# Altium project 3923Final.PrjPcb
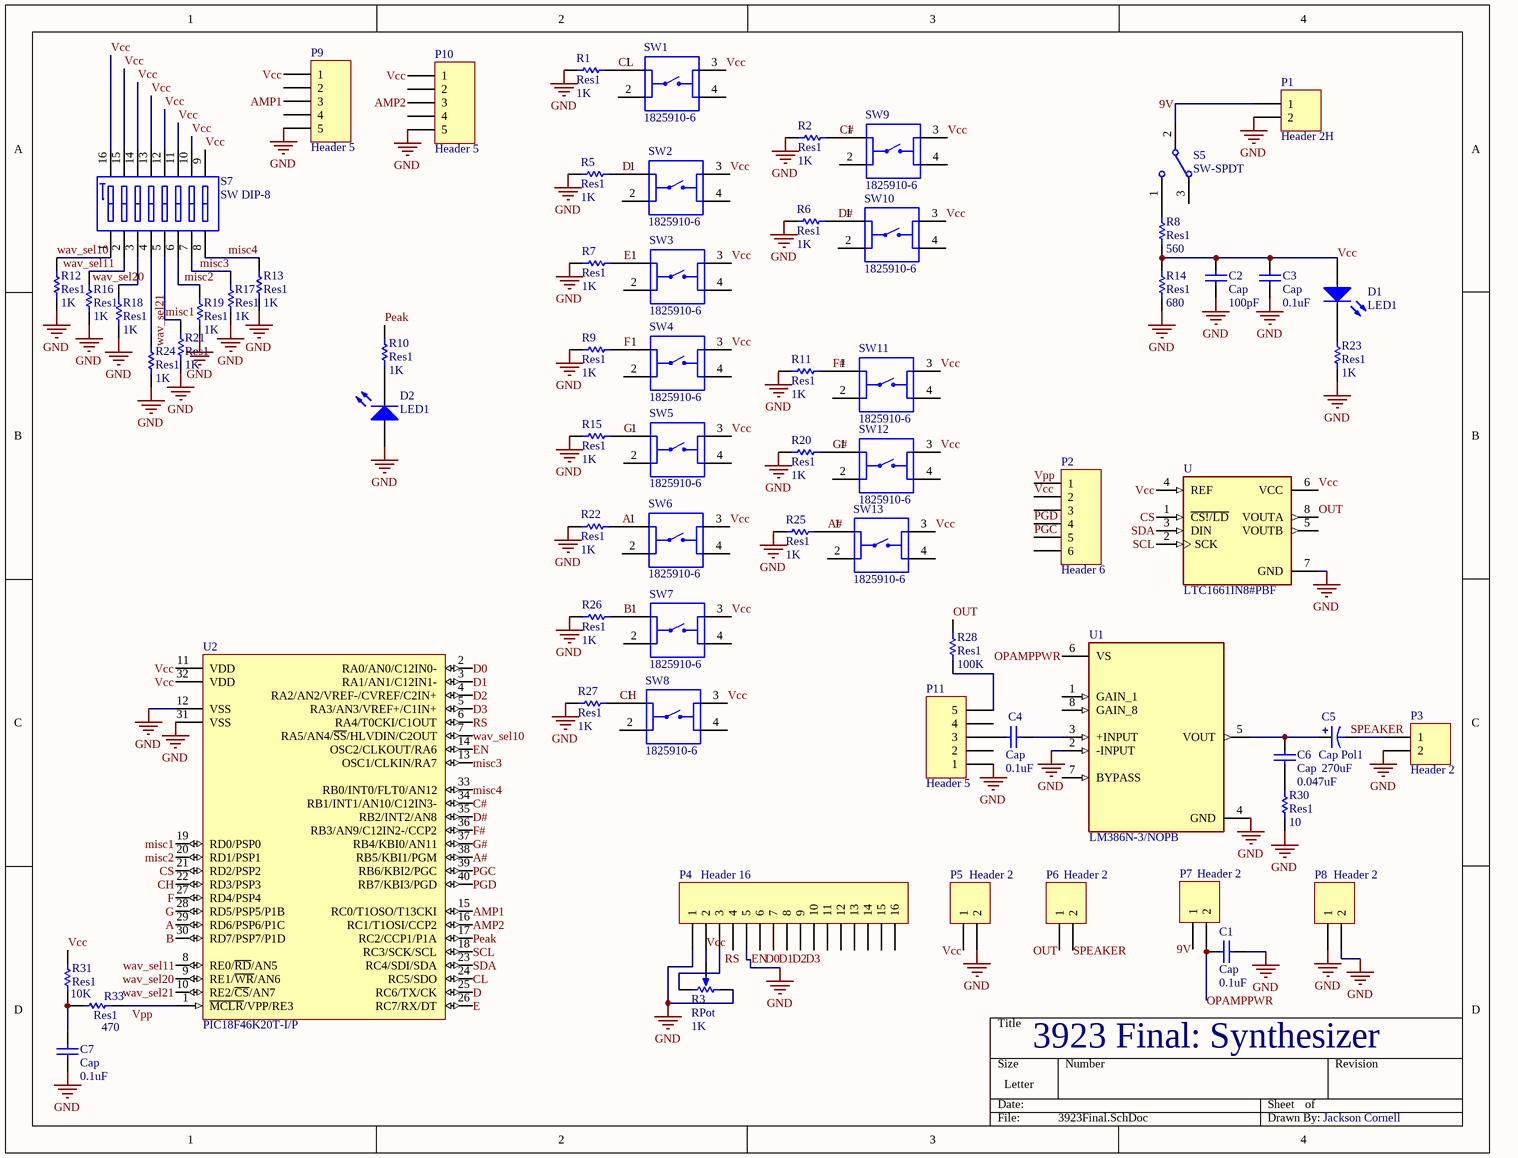
[diagram p0: 3923Final.SchDoc]
1 sheet, 68 parts. Net scope: global (net labels, ports and power ports of the same name join across sheets).
Board file: 3923Final.PcbDoc

## Sheet 3923Final.SchDoc
size Letter

### Parts
C1  Cap  value 0.1uF  [RAD-0.3]
C2  Cap  value 100pF  [RAD-0.3]
C3  Cap  value 0.1uF  [RAD-0.3]
C4  Cap  value 0.1uF  [RAD-0.3]
C5  Cap Pol1  value 270uF  [RB7.6-15]
C6  Cap  value 0.047uF  [RAD-0.3]
C7  Cap  value 0.1uF  [RAD-0.3]
D1  LED1  [LED-1]
D2  LED1  [LED-1]
P1  Header 2H  [HDR1X2H]
P2  Header 6  [HDR1X6]
P3  Header 2  [HDR1X2]
P4  Header 16  [HDR1X16]
P5  Header 2  [HDR1X2]
P6  Header 2  [HDR1X2]
P7  Header 2  [HDR1X2]
P8  Header 2  [HDR1X2]
P9  Header 5  [HDR1X5]
P10  Header 5  [HDR1X5]
P11  Header 5  [HDR1X5]
R1  Res1  value 1K  [AXIAL-0.3]
R2  Res1  value 1K  [AXIAL-0.3]
R3  RPot  value 1K  [VR5]
R5  Res1  value 1K  [AXIAL-0.3]
R6  Res1  value 1K  [AXIAL-0.3]
R7  Res1  value 1K  [AXIAL-0.3]
R8  Res1  value 560  [AXIAL-0.3]
R9  Res1  value 1K  [AXIAL-0.3]
R10  Res1  value 1K  [AXIAL-0.3]
R11  Res1  value 1K  [AXIAL-0.3]
R12  Res1  value 1K  [AXIAL-0.3]
R13  Res1  value 1K  [AXIAL-0.3]
R14  Res1  value 680  [AXIAL-0.3]
R15  Res1  value 1K  [AXIAL-0.3]
R16  Res1  value 1K  [AXIAL-0.3]
R17  Res1  value 1K  [AXIAL-0.3]
R18  Res1  value 1K  [AXIAL-0.3]
R19  Res1  value 1K  [AXIAL-0.3]
R20  Res1  value 1K  [AXIAL-0.3]
R21  Res1  value 1K  [AXIAL-0.3]
R22  Res1  value 1K  [AXIAL-0.3]
R23  Res1  value 1K  [AXIAL-0.3]
R24  Res1  value 1K  [AXIAL-0.3]
R25  Res1  value 1K  [AXIAL-0.3]
R26  Res1  value 1K  [AXIAL-0.3]
R27  Res1  value 1K  [AXIAL-0.3]
R28  Res1  value 100K  [AXIAL-0.3]
R30  Res1  value 10  [AXIAL-0.3]
R31  Res1  value 10K  [AXIAL-0.3]
R33  Res1  value 470  [AXIAL-0.3]
S5  SW-SPDT  [TL36WW15050]
S7  SW DIP-8  [DIP-16]
SW1  1825910-6  [SW_1825910-6-4]
SW2  1825910-6  [SW_1825910-6-4]
SW3  1825910-6  [SW_1825910-6-4]
SW4  1825910-6  [SW_1825910-6-4]
SW5  1825910-6  [SW_1825910-6-4]
SW6  1825910-6  [SW_1825910-6-4]
SW7  1825910-6  [SW_1825910-6-4]
SW8  1825910-6  [SW_1825910-6-4]
SW9  1825910-6  [SW_1825910-6-4]
SW10  1825910-6  [SW_1825910-6-4]
SW11  1825910-6  [SW_1825910-6-4]
SW12  1825910-6  [SW_1825910-6-4]
SW13  1825910-6  [SW_1825910-6-4]
U  LTC1661IN8#PBF  [DIP794W45P254L959H508Q8]
U1  LM386N-3/NOPB  [DIP794W45P254L959H508Q8]
U2  PIC18F46K20T-I/P  [PDIP600-P40]

### Nets
GND: C1.1 C2.1 C3.1 C7.1 D2.1(A) P1.2 P3.2 P4.1 P4.5 P5.2 P8.1 P8.2 P9.5 P10.5 P11.1 R1.1 R2.2 R3.1(TOP) R5.2 R6.2 R7.2 R9.2 R11.2 R12.1 R13.2 R14.1 R15.2 R16.1 R17.2 R18.2 R19.2 R20.2 R21.2 R22.2 R23.2 R24.2 R25.2 R26.2 R27.2 R30.2 U.7(GND) U1.2(-INPUT) U1.4(GND) U2.12(VSS) U2.31(VSS)
9V: P1.1 P7.1 S5.2
A: R22.1 SW6.1 U2.29(RD6/PSP6/P1C)
A#: R25.1 SW13.1 U2.38(RB5/KBI1/PGM)
AMP1: P9.3 U2.15(RC0/T1OSO/T13CKI)
AMP2: P10.3 U2.16(RC1/T1OSI/CCP2)
B: R26.1 SW7.1 U2.30(RD7/PSP7/P1D)
C#: R2.1 SW9.1 U2.34(RB1/INT1/AN10/C12IN3-)
CH: R27.1 SW8.1 U2.22(RD3/PSP3)
CL: R1.2 SW1.1 U2.24(RC5/SDO)
CS: U.1(~{CS!/LD}) U2.21(RD2/PSP2)
D: R5.1 SW2.1 U2.25(RC6/TX/CK)
D0: P4.7 U2.2(RA0/AN0/C12IN0-)
D1: P4.8 U2.3(RA1/AN1/C12IN1-)
D2: P4.9 U2.4(RA2/AN2/VREF-/CVREF/C2IN+)
D3: P4.10 U2.5(RA3/AN3/VREF+/C1IN+)
D#: R6.1 SW10.1 U2.35(RB2/INT2/AN8)
E: R7.1 SW3.1 U2.26(RC7/RX/DT)
EN: P4.6 U2.14(OSC2/CLKOUT/RA6)
F: R9.1 SW4.1 U2.27(RD4/PSP4)
F#: R11.1 SW11.1 U2.36(RB3/AN9/C12IN2-/CCP2)
G: R15.1 SW5.1 U2.28(RD5/PSP5/P1B)
G#: R20.1 SW12.1 U2.37(RB4/KBI0/AN11)
misc1: R21.1 S7.5(A5) U2.19(RD0/PSP0)
misc2: R19.1 S7.6(A6) U2.20(RD1/PSP1)
misc3: R17.1 S7.7(A7) U2.13(OSC1/CLKIN/RA7)
misc4: R13.1 S7.8(A8) U2.33(RB0/INT0/FLT0/AN12)
OPAMPPWR: C1.2 P7.2 U1.6(VS)
OUT: P6.1 R28.2 U.8(VOUTA)
Peak: R10.1 U2.17(RC2/CCP1/P1A)
PGC: P2.5 U2.39(RB6/KBI2/PGC)
PGD: P2.4 U2.40(RB7/KBI3/PGD)
RS: P4.4 U2.6(RA4/T0CKI/C1OUT)
SCL: U.2(SCK) U2.18(RC3/SCK/SCL)
SDA: U.3(DIN) U2.23(RC4/SDI/SDA)
SPEAKER: C5.2 P3.1 P6.2
Vcc: C2.2 C3.2 D1.1(A) P2.2 P4.2 P5.1 P9.1 P10.1 R3.3(TAP) R8.1 R14.2 R31.2 S7.9(B8) S7.10(B7) S7.11(B6) S7.12(B5) S7.13(B4) S7.14(B3) S7.15(B2) S7.16(B1) SW1.3 SW2.3 SW3.3 SW4.3 SW5.3 SW6.3 SW7.3 SW8.3 SW9.3 SW10.3 SW11.3 SW12.3 SW13.3 U.4(REF) U.6(VCC) U2.11(VDD) U2.32(VDD)
Vpp: P2.1 R33.1 U2.1(~{MCLR}/VPP/RE3)
wav_sel10: R12.2 S7.1(A1) U2.7(RA5/AN4/~{SS}/HLVDIN/C2OUT)
wav_sel11: R16.2 S7.2(A2) U2.8(RE0/~{RD}/AN5)
wav_sel20: R18.1 S7.3(A3) U2.9(RE1/~{WR}/AN6)
wav_sel21: R24.1 S7.4(A4) U2.10(RE2/~{CS}/AN7)
NetC4_1: C4.1 P11.3
NetC4_2: C4.2 U1.3(+INPUT)
NetC5_1: C5.1 C6.2 U1.5(VOUT)
NetC6_1: C6.1 R30.1
NetC7_2: C7.2 R31.1 R33.2
NetD1_2: D1.2(K) R23.1
NetD2_2: D2.2(K) R10.2
NetP4_3: P4.3 R3.2(BOT)
NetP11_5: P11.5 R28.1
NetR8_2: R8.2 S5.1

Not connected (* = marked no-connect by the designer): P2 3 6; P4 11 12 13 14 15 16; P9 2 4; P10 2 4; P11 2 4; S5 3; SW1 2 4; SW2 2 4; SW3 2 4; SW4 2 4; SW5 2 4; SW6 2 4; SW7 2 4; SW8 2 4; SW9 2 4; SW10 2 4; SW11 2 4; SW12 2 4; SW13 2 4; U 5(VOUTB); U1 1(GAIN_1) 7(BYPASS) 8(GAIN_8)

### Notes on the sheet
- 3923 Final: Synthesizer
- Jackson Cornell

### Library data of the parts
C1-C4 C6 C7 = Cap: Capacitor; Published: 8-Jun-2000; LatestRevisionDate: 17-Jul-2002; LatestRevisionNote: Re-released for DXP Platform.; PackageReference: RAD-0.3; Publisher: Altium Limited; PackageDescription: Radial Cap, Thru-Hole; 2 Leads; 0.3 in Pin Spacing
C5 = Cap Pol1: Polarized Capacitor (Radial); Published: 8-Jun-2000; LatestRevisionDate: 17-Jul-2002; LatestRevisionNote: Re-released for DXP Platform.; PackageReference: RB7.6-15; Publisher: Altium Limited; PackageDescription: Polarized Capacitor (Radial); 2 Leads
D1 D2 = LED1: Typical RED GaAs LED; Published: 8-Jun-2000; LatestRevisionDate: 08-Jul-2005; LatestRevisionNote: Mech Layer 1 removed.; PackageReference: LED-1; Publisher: Altium Limited; PackageDescription: LED; 2 Leads
P1 = Header 2H: Header, 2-Pin, Right Angle; LatestRevisionDate: 17-Jul-2002; LatestRevisionNote: Re-released for DXP Platform.; Publisher: Altium Limited
P2 = Header 6: Header, 6-Pin; LatestRevisionDate: 17-Jul-2002; LatestRevisionNote: Re-released for DXP Platform.; Publisher: Altium Limited
P3 P5-P8 = Header 2: Header, 2-Pin; LatestRevisionDate: 17-Jul-2002; LatestRevisionNote: Re-released for DXP Platform.; Publisher: Altium Limited
P4 = Header 16: Header, 16-Pin; LatestRevisionDate: 17-Jul-2002; LatestRevisionNote: Re-released for DXP Platform.; Publisher: Altium Limited
P9-P11 = Header 5: Header, 5-Pin; LatestRevisionDate: 17-Jul-2002; LatestRevisionNote: Re-released for DXP Platform.; Publisher: Altium Limited
R1 R2 R5-R28 R30 R31 R33 = Res1: Resistor; Published: 8-Jun-2000; LatestRevisionDate: 17-Jul-2002; LatestRevisionNote: Re-released for DXP Platform.; PackageReference: AXIAL-0.3; Publisher: Altium Limited; PackageDescription: Axial Device, Thru-Hole; 2 Leads; 0.3 in Pin Spacing
R3 = RPot: Potentiometer; Sim Note: Enter the Resistance value and the set point into parameter fields.; Set Position: 0.5; Published: 8-Jun-2000; LatestRevisionDate: 17-Jul-2002; LatestRevisionNote: Re-released for DXP Platform.; PackageReference: VR5; Publisher: Altium Limited; PackageDescription: Variable Resistor, Thru-Hole; 3 Leads
S5 = SW-SPDT: SPDT Subminiature Toggle Switch, Right Angle Mounting, Vertical Actuation; Published: 24-Mar-1999; LatestRevisionDate: 17-Dec-2003; LatestRevisionNote: Schematic revised, PCB Footprint replaced.; DatasheetVersion: 05-Dec-2000; PackageReference: TL36WW15050; Publisher: Altium Limited; PackageDescription: Switch; 4 Leads; ComponentLink1Description: Manufacturer Link; ComponentLink1URL: http://www.apem.com
S7 = SW DIP-8: DIP Switch, 8 Position, SPST; Published: 24-Mar-1999; LatestRevisionDate: 17-Jul-2002; LatestRevisionNote: Re-released for DXP Platform.; PackageReference: DIP_SW_8WAY_SMD; Publisher: Altium Limited; PackageDescription: DIP Switch; 16 Leads
SW1-SW13 = 1825910-6: Switch Push Button OFF _ON_ SPST Round Button 0.05A 24VDC Momentary Contact PC Pins Thru-Hole; Configuration_Pole-Throw: Single Pole - Single Throw; MF: TE Connectivity; Contact_Current_Rating: 50 mA; Digi-Key_Purchase_URL: https://www.digikey.com/product-detail/en/te-connectivity-alcoswitch-switches/1825910-6/450-1650-ND/1632536?utm_source=snapeda&utm_medium=aggregator&utm_campaign=symbol; TE_purchase_URL: https://www.te.com/usa-en/product-1825910-6.html?te_bu=Cor&te_type=disp&te_campaign=seda_glo_cor-seda-global-disp-prtnr-fy19-seda-model-bom-cta_sma-317_1&elqCampaignId=32493; Value: *; Digi-Key_Part_Number: 450-1650-ND; SnapEDA_Link: https://www.snapeda.com/parts/1825910-6/TE%20Connectivity%20ALCOSWITCH%20Switches/view-part/424522/?ref=snap; EU_RoHS_Compliance: Compliant; MP: 1825910-6; Package: None
U = LTC1661IN8#PBF: 10 Bit Digital to Analog Converter 2 8-PDIP; MF: Linear Technology/Analog Devices; DigiKey-Purchase-URL: https://snapeda.com/shop?store=DigiKey&id=3218300; MP: LTC1661IN8#PBF; Value: *; Availability: Unavailable; Package: PDIP -8 Analog Devices; Mouser-Purchase-URL: https://snapeda.com/shop?store=Mouser&id=3218300; Price: None; SnapEDA_Link: https://www.snapeda.com/parts/LTC1661IN8%23PBF/Analog%20Devices/view-part/3218300/?ref=snap
U2 = PIC18F46K20T-I/P: Flash Microcontroller with 10-Bit A/D and nanoWatt Technology, 32K Flash, 40-Pin PDIP, Industrial Temperature Range, Tape and Reel; DatasheetVersion: revF, Sep-2009; PackageVersion: revBB, Aug-2009; PackageReference: PDIP600-P40; PackageDescription: 40-Lead Plastic Dual In-Line (P) - 600 mil Body [PDIP]; ComponentLink1Description: Manufacturer URL; ComponentLink1URL: http://www.microchip.com/; ComponentLink2Description: Datasheet; ComponentLink2URL: http://ww1.microchip.com/downloads/en/DeviceDoc/41303F.pdf; ComponentLink3Description: Package Specification; ComponentLink3URL: http://www.microchip.com/stellent/groups/techpub_sg/documents/packagingspec/en012702.pdf
U1 = LM386N-3/NOPB: Price: None; Package: None; Availability: Unavailable; MP: LM386N-3/NOPB; Value: *